# Altium schematic sheet 1_Power.SchDoc
size A3; DocumentNumber: 2; SheetNumber: 2; SheetTotal: 6
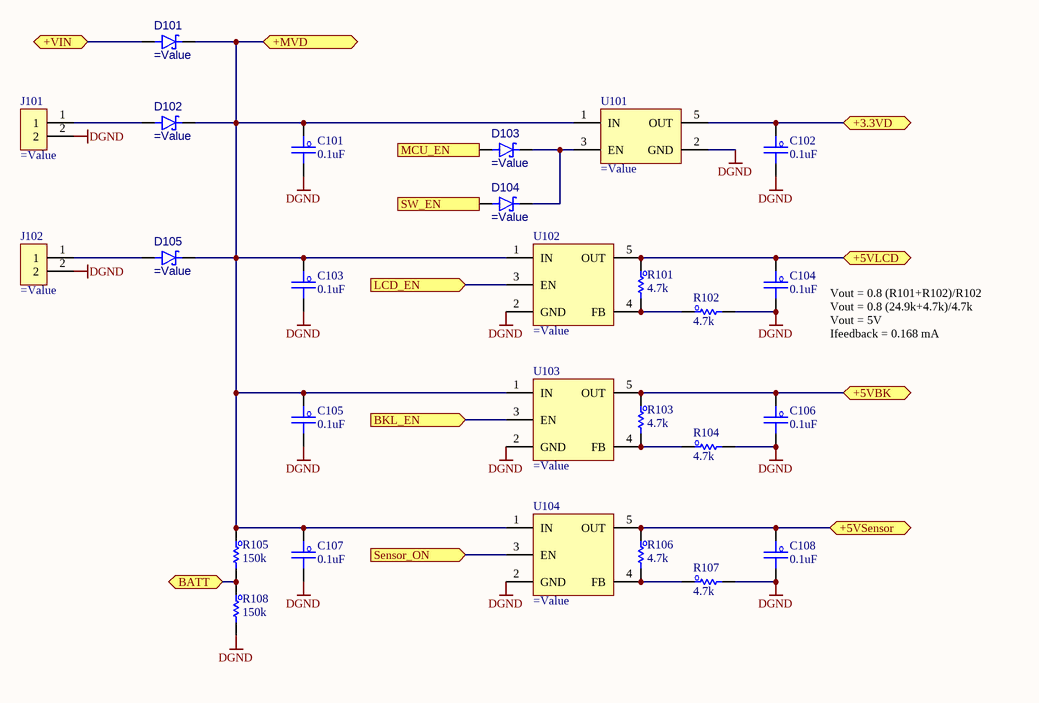
[diagram p0: 1_Power.SchDoc]

## Parts
C101  0.1uF  [C_0603]
C102  0.1uF  [C_0603]
C103  0.1uF  [C_0603]
C104  0.1uF  [C_0603]
C105  0.1uF  [C_0603]
C106  0.1uF  [C_0603]
C107  0.1uF  [C_0603]
C108  0.1uF  [C_0603]
D101  (no value)  [DIOM4325X250N]
D102  (no value)  [DIOM4325X250N]
D103  (no value)  [DIOM4325X250N]
D104  (no value)  [DIOM4325X250N]
D105  (no value)  [DIOM4325X250N]
J101  (no value)  [CON_2P_Header]
J102  (no value)  [CON_2P_Header]
R101  4.7k  [R_0603]
R102  4.7k  [R_0603]
R103  4.7k  [R_0603]
R104  4.7k  [R_0603]
R105  150k  [R_0603]
R106  4.7k  [R_0603]
R107  4.7k  [R_0603]
R108  150k  [R_0603]
U101  (no value)  [SOT95P280X125-5N]
U102  (no value)  [SOT95P280X145-5N]
U103  (no value)  [SOT95P280X145-5N]
U104  (no value)  [SOT95P280X145-5N]

## Ports
+3.3VD (bidir), +5VBK (bidir), +5VLCD (bidir), +5VSensor (bidir), +MVD (bidir), +VIN (bidir), BATT (bidir), BKL_EN (in), LCD_EN (in), MCU_EN (in), Sensor_ON (in), SW_EN (in)

## Nets
DGND: C101.2 C102.2 C103.2 C104.2 C105.2 C106.2 C107.2 C108.2 J101.2 J102.2 R102.2 R104.2 R107.2 R108.2 U101.2(GND) U102.2(GND) U103.2(GND) U104.2(GND)
+3.3VD: C102.1 U101.5(OUT) ; port +3.3VD
+5VBK: C106.1 R103.1 U103.5(OUT) ; port +5VBK
+5VLCD: C104.1 R101.1 U102.5(OUT) ; port +5VLCD
+5VSensor: C108.1 R106.1 U104.5(OUT) ; port +5VSensor
+MVD: C101.1 C103.1 C105.1 C107.1 D101.1 D102.1 D105.1 R105.1 U101.1(IN) U102.1(IN) U103.1(IN) U104.1(IN) ; port +MVD
+VIN: D101.2 ; port +VIN
BATT: R105.2 R108.1 ; port BATT
BKL_EN: U103.3(EN) ; port BKL_EN
LCD_EN: U102.3(EN) ; port LCD_EN
MCU_EN: D103.2 ; port MCU_EN
Sensor_ON: U104.3(EN) ; port Sensor_ON
SW_EN: D104.2 ; port SW_EN
NetD102_2: D102.2 J101.1
NetD103_1: D103.1 D104.1 U101.3(EN)
NetD105_2: D105.2 J102.1
NetR101_2: R101.2 R102.1 U102.4(FB)
NetR103_2: R103.2 R104.1 U103.4(FB)
NetR106_2: R106.2 R107.1 U104.4(FB)

## Notes on the sheet
- Vout = 0.8 (R101+R102)/R102
  Vout = 0.8 (24.9k+4.7k)/4.7k
  Vout = 5V
  Ifeedback = 0.168 mA
- Title :
- Revision :
- ผู้จัดทำ:
- Size:
- A3
- Time:
- ผู้เขียน:
- บริษัท ยูนิเวอร์แซล ยูทีลิตี้ส์ จำกัด (มหาชน) เลขที่ 1 อาคาร อีสท์วอเตอร์ ชั้น 18 ซอยวิภาวดีรังสิต 5 แขวงจอมพล เขตจตุจักร กรุงเทพฯ 10900
  Tel : +662-272-1688
  Fax :+662-2721690-1
- -
- Sheet:
- of
- ผู้อำนวยการ
- ผู้ตรวจสอบ:
- Number:
- กรรมการผู้จัดการ:
- File:

## Library data of the parts
C101-C108 = C_Capacitor: CAP CER 0.1UF 50V X7R 0603; Manufacturer: KEMET; PartNumber: C0603C104K5RACTU; PackageReference: 0603; PartID: 399-5089-1-ND; Value2: 50V; Value: 0.1uF; Value3: *
D101-D105 = D_PW_SK310A: DIODE SCHOTTKY 100V 3A DO214AC; Manufacturer: Taiwan Semiconductor Corporation; Value: SK310A R2; PartID: 0029-0147-1; PartNumber: SK310A R2
J101 J102 = CON_2P_Heder: Connector 2 position; PartNumber: 796866-2; Manufacturer: TE Connectivity AMP Connectors; Value: 796866-2; PartID: A98302-ND; PackageReference: TERM BLOCK; Value3: *
R101-R104 R106 R107 = R_Resister: RES 4.7K OHM 5% 1/10W 0603; Manufacturer: Vishay Dale; PartNumber: CRCW06034K70JNEBC; Value2: 0.1W; Value: 4.7k; PackageReference: 0603; PartID: 541-CRCW06034K70JNEBCCT-ND; Value3: *
R105 R108 = R_Resister: RES SMD 150K OHM 1% 1/10W 0603; Manufacturer: Vishay Dale; PartNumber: CRCW0603150KFKEAC; Value2: 0.1W; Value: 150k; PackageReference: 0603; PartID: 541-4034-1-ND; Value3: *
U101 = IC_LDO_BU33SD5WG-TR: IC REG LINEAR 3.3V 500MA 5SSOP; Manufacturer: Rohm Semiconductor; PartNumber: BU33SD5WG-TR; PartID: 0176-0571-3; PackageReference: SOT-753; Value: BU33SD5WG-TR; Value2: *; Value3: *
U102-U104 = IC_LDO_ZTP7001: 70dB@(1kHz) 600mA 65μA 420mV@600mA -40℃~+125℃@(Tj) Adjustable Positive 70uVrms 1 6V Overcurrent Protection，Enable, Thermal Protection SOT-23-5L Linear Voltage Regulators (LDO) ROHS; PartNumber: ZTP7001-00; Manufacturer: ZILLTEK; Value: ZTP7001-00; PartID: C481271; PackageReference: SOT-23-5; Value2: *; Value3: *